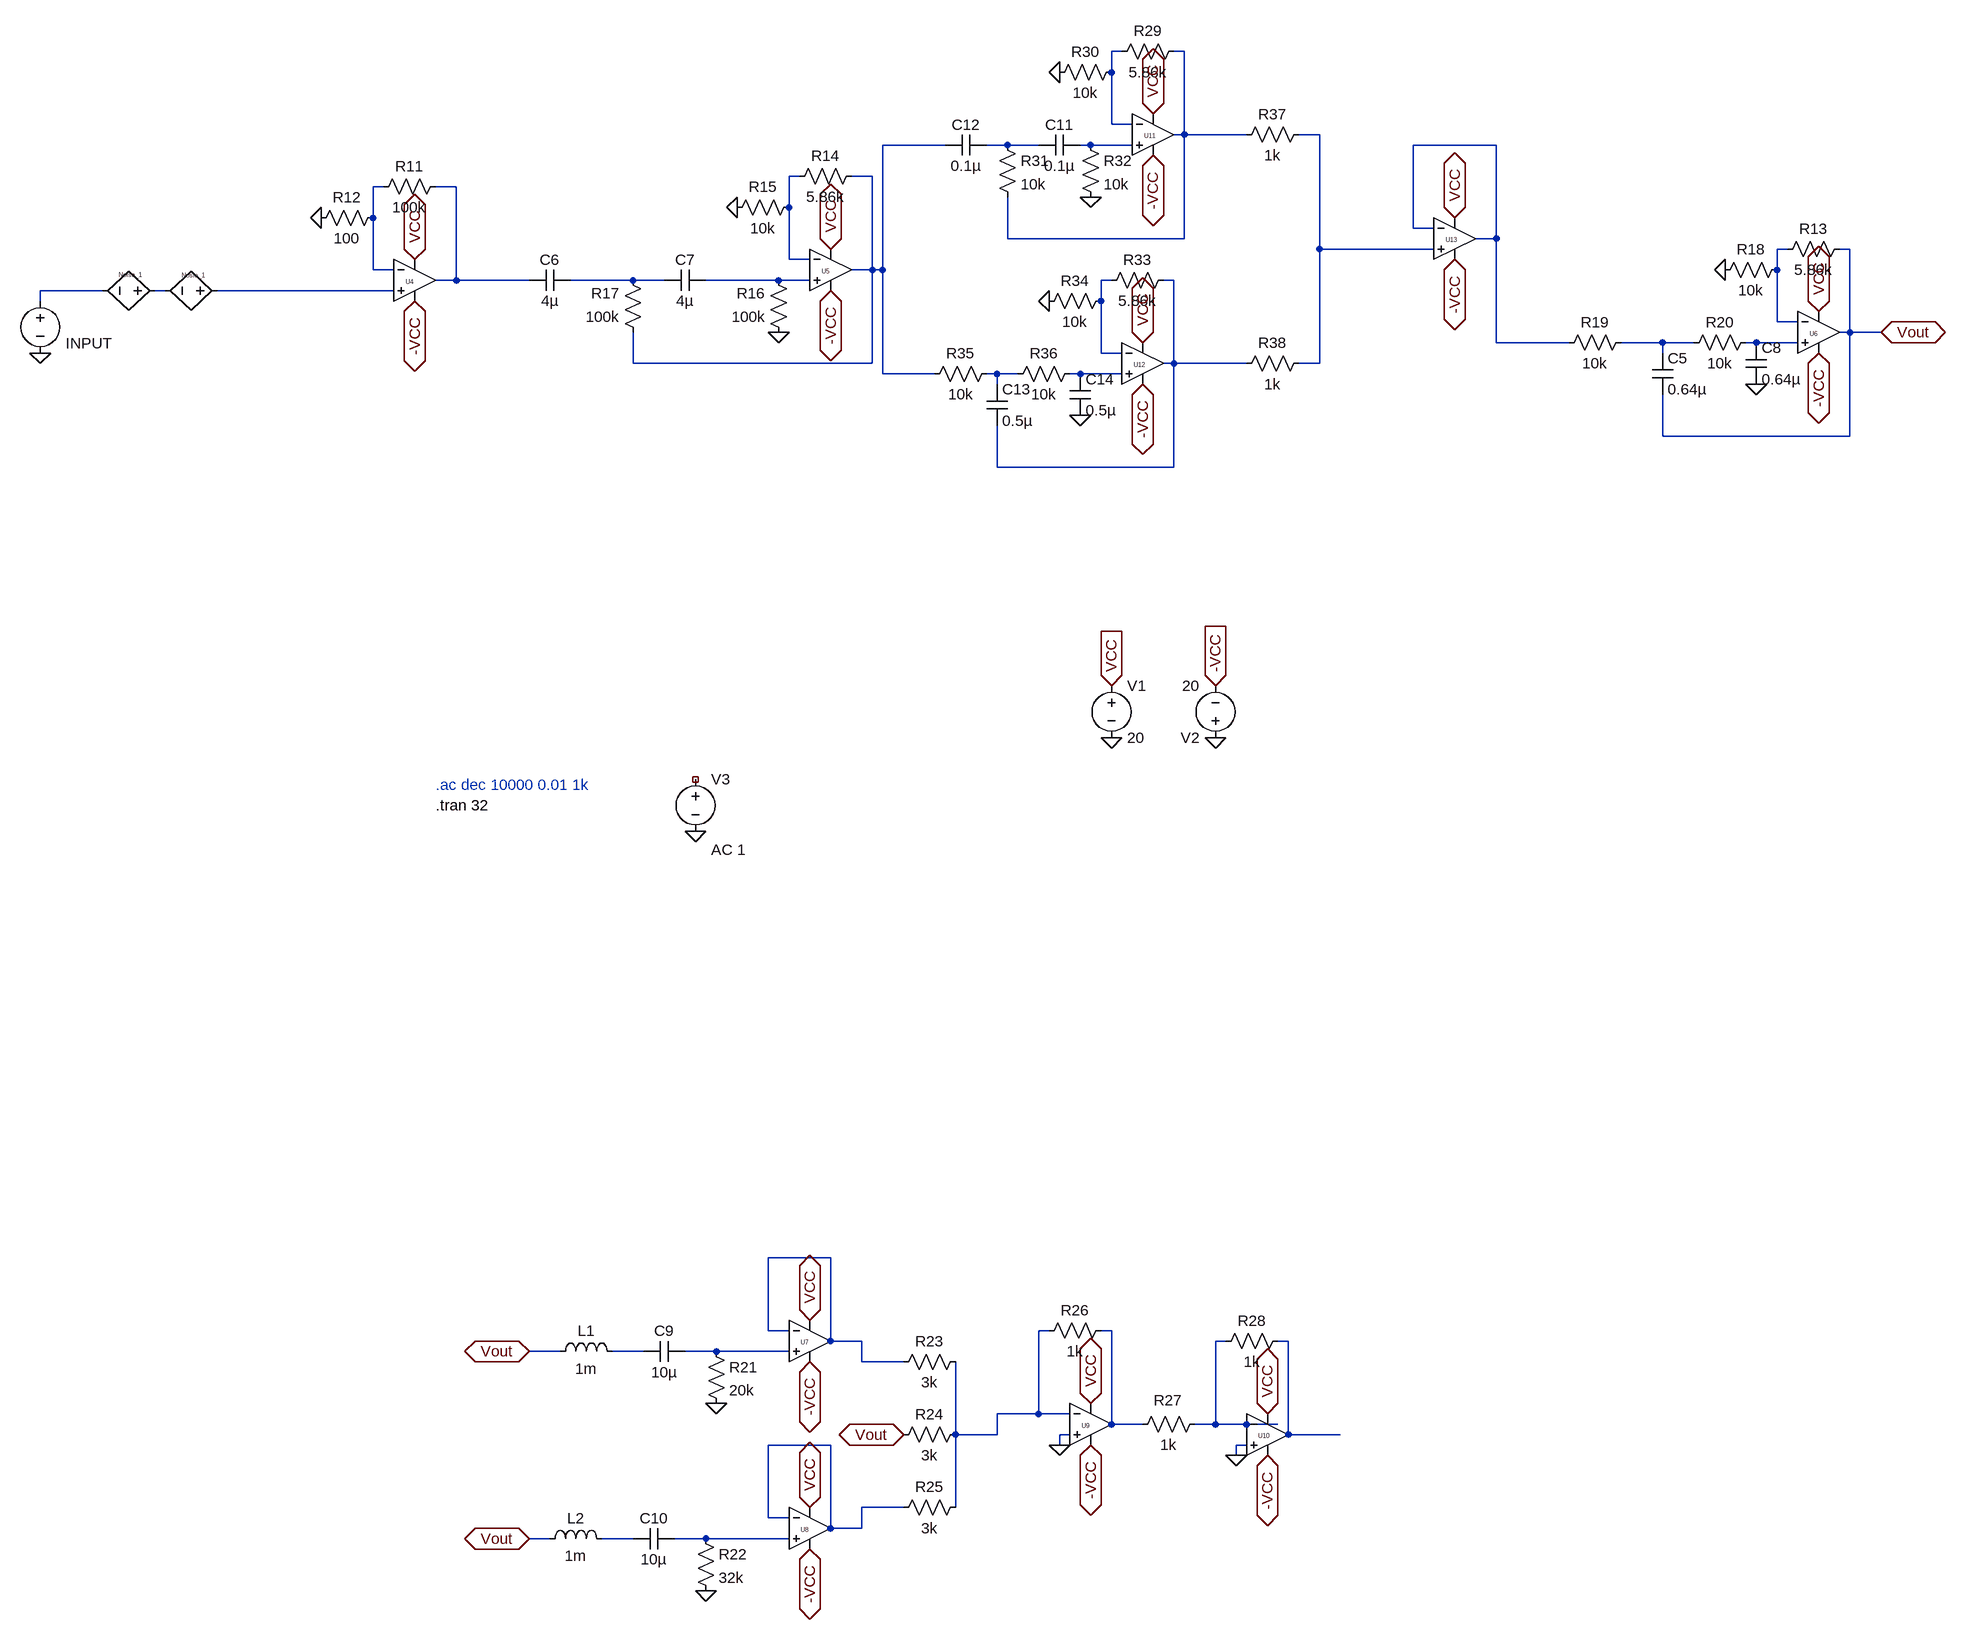
[diagram p0: schematic ECG processing.asc]
ECG processing.asc, the LTspice schematic file:
Version 4
SHEET 1 4004 2052
WIRE 1280 -368 1264 -368
WIRE 1376 -368 1360 -368
WIRE 1264 -336 1264 -368
WIRE 1264 -256 1264 -336
WIRE 1296 -256 1264 -256
WIRE 1376 -240 1376 -368
WIRE 1376 -240 1360 -240
WIRE 1472 -240 1376 -240
WIRE 1584 -240 1552 -240
WIRE 1008 -224 912 -224
WIRE 1104 -224 1072 -224
WIRE 1152 -224 1104 -224
WIRE 1232 -224 1216 -224
WIRE 1296 -224 1232 -224
WIRE 1856 -224 1728 -224
WIRE 784 -176 768 -176
WIRE 896 -176 864 -176
WIRE 144 -160 128 -160
WIRE 256 -160 224 -160
WIRE 768 -128 768 -176
WIRE 128 -112 128 -160
WIRE 1728 -96 1728 -224
WIRE 1760 -96 1728 -96
WIRE 1104 -80 1104 -144
WIRE 1376 -80 1376 -240
WIRE 1376 -80 1104 -80
WIRE 1856 -80 1856 -224
WIRE 1856 -80 1824 -80
WIRE 1584 -64 1584 -240
WIRE 1760 -64 1584 -64
WIRE 2304 -64 2288 -64
WIRE 2400 -64 2384 -64
WIRE 768 -48 768 -128
WIRE 800 -48 768 -48
WIRE 128 -32 128 -112
WIRE 160 -32 128 -32
WIRE 896 -32 896 -176
WIRE 896 -32 864 -32
WIRE 912 -32 912 -224
WIRE 912 -32 896 -32
WIRE 2288 -32 2288 -64
WIRE 256 -16 256 -160
WIRE 256 -16 224 -16
WIRE 368 -16 256 -16
WIRE 528 -16 432 -16
WIRE 576 -16 528 -16
WIRE 752 -16 640 -16
WIRE 800 -16 752 -16
WIRE 1264 -16 1248 -16
WIRE 1360 -16 1344 -16
WIRE -288 0 -384 0
WIRE -192 0 -208 0
WIRE 160 0 -112 0
WIRE -384 16 -384 0
WIRE 1248 16 1248 -16
WIRE 2288 48 2288 -32
WIRE 2320 48 2288 48
WIRE 2400 64 2400 -64
WIRE 2400 64 2384 64
WIRE 2448 64 2400 64
WIRE 1856 80 1856 -80
WIRE 1968 80 1856 80
WIRE 2112 80 2048 80
WIRE 2160 80 2112 80
WIRE 2256 80 2240 80
WIRE 2320 80 2256 80
WIRE 1248 96 1248 16
WIRE 1280 96 1248 96
WIRE 2112 96 2112 80
WIRE 528 112 528 64
WIRE 896 112 896 -32
WIRE 896 112 528 112
WIRE 1360 112 1360 -16
WIRE 1360 112 1344 112
WIRE 1472 112 1360 112
WIRE 1584 112 1584 -64
WIRE 1584 112 1552 112
WIRE 912 128 912 -32
WIRE 992 128 912 128
WIRE 1088 128 1072 128
WIRE 1120 128 1088 128
WIRE 1216 128 1200 128
WIRE 1280 128 1216 128
WIRE 1088 144 1088 128
WIRE 2112 224 2112 160
WIRE 2400 224 2400 64
WIRE 2400 224 2112 224
WIRE 1088 272 1088 208
WIRE 1360 272 1360 112
WIRE 1360 272 1088 272
WIRE 832 1488 736 1488
WIRE 736 1600 736 1488
WIRE 768 1600 736 1600
WIRE 1168 1600 1152 1600
WIRE 1264 1600 1248 1600
WIRE 832 1616 832 1488
WIRE 880 1616 832 1616
WIRE 1440 1616 1424 1616
WIRE 1536 1616 1520 1616
WIRE 416 1632 368 1632
WIRE 544 1632 496 1632
WIRE 656 1632 608 1632
WIRE 768 1632 656 1632
WIRE 880 1648 880 1616
WIRE 944 1648 880 1648
WIRE 1152 1728 1152 1600
WIRE 1152 1728 1088 1728
WIRE 1200 1728 1152 1728
WIRE 1264 1744 1264 1600
WIRE 1312 1744 1264 1744
WIRE 1424 1744 1424 1616
WIRE 1424 1744 1392 1744
WIRE 1472 1744 1424 1744
WIRE 1520 1744 1472 1744
WIRE 1024 1760 1024 1648
WIRE 1088 1760 1088 1728
WIRE 1088 1760 1024 1760
WIRE 1200 1760 1184 1760
WIRE 1536 1760 1536 1616
WIRE 1616 1760 1536 1760
WIRE 832 1776 736 1776
WIRE 1184 1776 1184 1760
WIRE 1472 1776 1456 1776
WIRE 1456 1792 1456 1776
WIRE 944 1872 880 1872
WIRE 1024 1872 1024 1760
WIRE 736 1888 736 1776
WIRE 768 1888 736 1888
WIRE 832 1904 832 1776
WIRE 880 1904 880 1872
WIRE 880 1904 832 1904
WIRE 400 1920 368 1920
WIRE 528 1920 480 1920
WIRE 640 1920 592 1920
WIRE 768 1920 640 1920
FLAG 1264 688 0
FLAG 1424 688 0
FLAG 1264 608 VCC
IOPIN 1264 608 In
FLAG 1424 608 -VCC
IOPIN 1424 608 In
FLAG 624 832 0
FLAG 832 -64 VCC
IOPIN 832 -64 BiDir
FLAG 832 0 -VCC
IOPIN 832 0 BiDir
FLAG 688 -128 0
FLAG 752 64 0
FLAG 192 -48 VCC
IOPIN 192 -48 BiDir
FLAG 192 16 -VCC
IOPIN 192 16 BiDir
FLAG 48 -112 0
FLAG -384 96 0
FLAG 2352 32 VCC
IOPIN 2352 32 BiDir
FLAG 2352 96 -VCC
IOPIN 2352 96 BiDir
FLAG 2208 -32 0
FLAG 2256 144 0
FLAG 656 1712 0
FLAG 640 2000 0
FLAG 2448 64 Vout
IOPIN 2448 64 BiDir
FLAG 368 1632 Vout
IOPIN 368 1632 BiDir
FLAG 368 1920 Vout
IOPIN 368 1920 BiDir
FLAG 800 1584 VCC
IOPIN 800 1584 BiDir
FLAG 800 1648 -VCC
IOPIN 800 1648 BiDir
FLAG 800 1872 VCC
IOPIN 800 1872 BiDir
FLAG 800 1936 -VCC
IOPIN 800 1936 BiDir
FLAG 1232 1712 VCC
IOPIN 1232 1712 BiDir
FLAG 1232 1776 -VCC
IOPIN 1232 1776 BiDir
FLAG 1184 1776 0
FLAG 944 1760 Vout
IOPIN 944 1760 BiDir
FLAG 1504 1728 VCC
IOPIN 1504 1728 BiDir
FLAG 1504 1792 -VCC
IOPIN 1504 1792 BiDir
FLAG 1456 1792 0
FLAG 1328 -272 VCC
IOPIN 1328 -272 BiDir
FLAG 1328 -208 -VCC
IOPIN 1328 -208 BiDir
FLAG 1184 -336 0
FLAG 1232 -144 0
FLAG 1312 80 VCC
IOPIN 1312 80 BiDir
FLAG 1312 144 -VCC
IOPIN 1312 144 BiDir
FLAG 1168 16 0
FLAG 1216 192 0
FLAG 1792 -112 VCC
IOPIN 1792 -112 BiDir
FLAG 1792 -48 -VCC
IOPIN 1792 -48 BiDir
SYMBOL voltage 1264 592 R0
WINDOW 123 0 0 Left 0
WINDOW 39 0 0 Left 0
SYMATTR InstName V1
SYMATTR Value 20
SYMBOL voltage 1424 704 R180
WINDOW 123 0 0 Left 0
WINDOW 39 0 0 Left 0
SYMATTR InstName V2
SYMATTR Value 20
SYMBOL voltage 624 736 R0
WINDOW 123 24 124 Left 2
WINDOW 39 0 0 Left 0
SYMATTR Value2 AC 1
SYMATTR InstName V3
SYMATTR Value ""
SYMBOL OpAmps\\UniversalOpAmp2 832 -32 R0
WINDOW 0 -14 2 Left 0
SYMATTR InstName U5
SYMBOL res 880 -192 R90
WINDOW 0 0 56 VBottom 2
WINDOW 3 32 56 VTop 2
SYMATTR InstName R14
SYMATTR Value 5.86k
SYMBOL res 784 -144 R90
WINDOW 0 0 56 VBottom 2
WINDOW 3 32 56 VTop 2
SYMATTR InstName R15
SYMATTR Value 10k
SYMBOL res 768 80 R180
WINDOW 0 36 76 Left 2
WINDOW 3 36 40 Left 2
SYMATTR InstName R16
SYMATTR Value 100k
SYMBOL cap 432 -32 R90
WINDOW 0 0 32 VBottom 2
WINDOW 3 32 32 VTop 2
SYMATTR InstName C6
SYMATTR Value 4µ
SYMBOL cap 640 -32 R90
WINDOW 0 0 32 VBottom 2
WINDOW 3 32 32 VTop 2
SYMATTR InstName C7
SYMATTR Value 4µ
SYMBOL res 544 80 R180
WINDOW 0 36 76 Left 2
WINDOW 3 36 40 Left 2
SYMATTR InstName R17
SYMATTR Value 100k
SYMBOL OpAmps\\UniversalOpAmp2 192 -16 R0
WINDOW 0 -14 2 Left 0
SYMATTR InstName U4
SYMBOL res 240 -176 R90
WINDOW 0 0 56 VBottom 2
WINDOW 3 32 56 VTop 2
SYMATTR InstName R11
SYMATTR Value 100k
SYMBOL res 144 -128 R90
WINDOW 0 0 56 VBottom 2
WINDOW 3 32 56 VTop 2
SYMATTR InstName R12
SYMATTR Value 100
SYMBOL voltage -384 0 R0
WINDOW 0 39 81 Left 2
WINDOW 3 24 96 Invisible 2
WINDOW 123 24 44 Left 2
WINDOW 39 0 0 Left 0
SYMATTR InstName INPUT
SYMATTR Value PWL file="C:\Users\Varad\Downloads\data (1).txt"
SYMBOL OpAmps\\UniversalOpAmp2 2352 64 R0
WINDOW 0 -14 2 Left 0
SYMATTR InstName U6
SYMBOL res 2288 -48 R270
WINDOW 0 32 56 VTop 2
WINDOW 3 0 56 VBottom 2
SYMATTR InstName R13
SYMATTR Value 5.86k
SYMBOL res 2192 -16 R270
WINDOW 0 32 56 VTop 2
WINDOW 3 0 56 VBottom 2
SYMATTR InstName R18
SYMATTR Value 10k
SYMBOL res 2064 64 R90
WINDOW 0 0 56 VBottom 2
WINDOW 3 32 56 VTop 2
SYMATTR InstName R19
SYMATTR Value 10k
SYMBOL res 2256 64 R90
WINDOW 0 0 56 VBottom 2
WINDOW 3 32 56 VTop 2
SYMATTR InstName R20
SYMATTR Value 10k
SYMBOL cap 2096 96 R0
SYMATTR InstName C5
SYMATTR Value 0.64µ
SYMBOL cap 2240 80 R0
SYMATTR InstName C8
SYMATTR Value 0.64µ
SYMBOL bv -192 0 R90
WINDOW 0 -18 53 VBottom 0
WINDOW 3 -4 56 Invisible 2
SYMATTR InstName Noise_1
SYMATTR Value V=WHITE(314*time)*0.0001
SYMBOL bv -96 0 R90
WINDOW 0 -17 52 VBottom 0
WINDOW 3 32 56 Invisible 2
SYMATTR InstName Nosie_1
SYMATTR Value V= idt(white(0.628*time))*0.00001
SYMBOL ind 400 1648 R270
WINDOW 0 32 56 VTop 2
WINDOW 3 5 56 VBottom 2
SYMATTR InstName L1
SYMATTR Value 1m
SYMBOL cap 608 1616 R90
WINDOW 0 0 32 VBottom 2
WINDOW 3 32 32 VTop 2
SYMATTR InstName C9
SYMATTR Value 10µ
SYMBOL res 640 1616 R0
SYMATTR InstName R21
SYMATTR Value 20k
SYMBOL ind 384 1936 R270
WINDOW 0 32 56 VTop 2
WINDOW 3 5 56 VBottom 2
SYMATTR InstName L2
SYMATTR Value 1m
SYMBOL cap 592 1904 R90
WINDOW 0 0 32 VBottom 2
WINDOW 3 32 32 VTop 2
SYMATTR InstName C10
SYMATTR Value 10µ
SYMBOL res 624 1904 R0
SYMATTR InstName R22
SYMATTR Value 32k
SYMBOL OpAmps\\UniversalOpAmp2 800 1616 R0
WINDOW 0 -14 2 Left 0
SYMATTR InstName U7
SYMBOL OpAmps\\UniversalOpAmp2 800 1904 R0
WINDOW 0 -14 2 Left 0
SYMATTR InstName U8
SYMBOL res 1040 1632 R90
WINDOW 0 0 56 VBottom 2
WINDOW 3 32 56 VTop 2
SYMATTR InstName R23
SYMATTR Value 3k
SYMBOL res 1040 1744 R90
WINDOW 0 0 56 VBottom 2
WINDOW 3 32 56 VTop 2
SYMATTR InstName R24
SYMATTR Value 3k
SYMBOL res 1040 1856 R90
WINDOW 0 0 56 VBottom 2
WINDOW 3 32 56 VTop 2
SYMATTR InstName R25
SYMATTR Value 3k
SYMBOL OpAmps\\UniversalOpAmp2 1232 1744 R0
WINDOW 0 -14 2 Left 0
SYMATTR InstName U9
SYMBOL res 1264 1584 R90
WINDOW 0 0 56 VBottom 2
WINDOW 3 32 56 VTop 2
SYMATTR InstName R26
SYMATTR Value 1k
SYMBOL res 1408 1728 R90
WINDOW 0 -5 57 VBottom 2
WINDOW 3 32 56 VTop 2
SYMATTR InstName R27
SYMATTR Value 1k
SYMBOL OpAmps\\UniversalOpAmp2 1504 1760 R0
WINDOW 0 -14 2 Left 0
SYMATTR InstName U10
SYMBOL res 1536 1600 R90
WINDOW 0 0 56 VBottom 2
WINDOW 3 32 56 VTop 2
SYMATTR InstName R28
SYMATTR Value 1k
SYMBOL OpAmps\\UniversalOpAmp2 1328 -240 R0
WINDOW 0 -14 2 Left 0
SYMATTR InstName U11
SYMBOL res 1264 -352 R270
WINDOW 0 32 56 VTop 2
WINDOW 3 0 56 VBottom 2
SYMATTR InstName R29
SYMATTR Value 5.86k
SYMBOL res 1168 -320 R270
WINDOW 0 32 56 VTop 2
WINDOW 3 0 56 VBottom 2
SYMATTR InstName R30
SYMATTR Value 10k
SYMBOL res 1088 -240 R0
SYMATTR InstName R31
SYMATTR Value 10k
SYMBOL res 1216 -240 R0
SYMATTR InstName R32
SYMATTR Value 10k
SYMBOL cap 1216 -240 R90
WINDOW 0 0 32 VBottom 2
WINDOW 3 32 32 VTop 2
SYMATTR InstName C11
SYMATTR Value 0.1µ
SYMBOL cap 1072 -240 R90
WINDOW 0 0 32 VBottom 2
WINDOW 3 32 32 VTop 2
SYMATTR InstName C12
SYMATTR Value 0.1µ
SYMBOL OpAmps\\UniversalOpAmp2 1312 112 R0
WINDOW 0 -14 2 Left 0
SYMATTR InstName U12
SYMBOL res 1248 0 R270
WINDOW 0 32 56 VTop 2
WINDOW 3 0 56 VBottom 2
SYMATTR InstName R33
SYMATTR Value 5.86k
SYMBOL res 1152 32 R270
WINDOW 0 32 56 VTop 2
WINDOW 3 0 56 VBottom 2
SYMATTR InstName R34
SYMATTR Value 10k
SYMBOL res 1088 112 R90
WINDOW 0 0 56 VBottom 2
WINDOW 3 32 56 VTop 2
SYMATTR InstName R35
SYMATTR Value 10k
SYMBOL res 1216 112 R90
WINDOW 0 0 56 VBottom 2
WINDOW 3 32 56 VTop 2
SYMATTR InstName R36
SYMATTR Value 10k
SYMBOL cap 1072 144 R0
SYMATTR InstName C13
SYMATTR Value 0.5µ
SYMBOL cap 1200 128 R0
SYMATTR InstName C14
SYMATTR Value 0.5µ
SYMBOL OpAmps\\UniversalOpAmp2 1792 -80 R0
WINDOW 0 -14 2 Left 0
SYMATTR InstName U13
SYMBOL res 1568 -256 R90
WINDOW 0 0 56 VBottom 2
WINDOW 3 32 56 VTop 2
SYMATTR InstName R37
SYMATTR Value 1k
SYMBOL res 1568 96 R90
WINDOW 0 0 56 VBottom 2
WINDOW 3 32 56 VTop 2
SYMATTR InstName R38
SYMATTR Value 1k
TEXT 224 760 Left 2 ;.ac dec 10000 0.01 1k
TEXT 224 792 Left 2 !.tran 32

The netlist it stands for:
* ECG processing.asc
V1 VCC 0 20
V2 0 -VCC 20
V3 NC_01 0 AC 1
XU5 N013 N008 VCC -VCC N004 level2 Avol=1Meg GBW=10Meg Slew=10Meg Ilimit=25m Rail=0 Vos=0 En=0 Enk=0 In=0 Ink=0 Rin=500Meg  ; pins In+ In- V+ V- OUT
R14 N004 N008 5.86k
R15 N008 0 10k
R16 0 N013 100k
C6 N012 N010 4µ
C7 N013 N012 4µ
R17 N004 N012 100k
XU4 N018 N009 VCC -VCC N010 level2 Avol=1Meg GBW=10Meg Slew=10Meg Ilimit=25m Rail=0 Vos=0 En=0 Enk=0 In=0 Ink=0 Rin=500Meg  ; pins In+ In- V+ V- OUT
R11 N010 N009 100k
R12 N009 0 100
V§INPUT N016 0 PWL file="C:\Users\Varad\Downloads\data (1).txt"
XU6 N020 N011 VCC -VCC Vout level2 Avol=1Meg GBW=10Meg Slew=10Meg Ilimit=25m Rail=0 Vos=0 En=0 Enk=0 In=0 Ink=0 Rin=500Meg  ; pins In+ In- V+ V- OUT
R13 N011 Vout 5.86k
R18 0 N011 10k
R19 N019 N007 10k
R20 N020 N019 10k
C5 N019 Vout 0.64µ
C8 N020 0 0.64µ
B§Noise_1 N017 N016 V=WHITE(314*time)*0.0001
B§Nosie_1 N018 N017 V= idt(white(0.628*time))*0.00001
L1 Vout N028 1m
C9 N029 N028 10µ
R21 N029 0 20k
L2 Vout N031 1m
C10 N032 N031 10µ
R22 N032 0 32k
XU7 N029 N023 VCC -VCC N023 level2 Avol=1Meg GBW=10Meg Slew=10Meg Ilimit=25m Rail=0 Vos=0 En=0 Enk=0 In=0 Ink=0 Rin=500Meg  ; pins In+ In- V+ V- OUT
XU8 N032 N030 VCC -VCC N030 level2 Avol=1Meg GBW=10Meg Slew=10Meg Ilimit=25m Rail=0 Vos=0 En=0 Enk=0 In=0 Ink=0 Rin=500Meg  ; pins In+ In- V+ V- OUT
R23 N024 N023 3k
R24 N024 Vout 3k
R25 N024 N030 3k
XU9 0 N024 VCC -VCC N025 level2 Avol=1Meg GBW=10Meg Slew=10Meg Ilimit=25m Rail=0 Vos=0 En=0 Enk=0 In=0 Ink=0 Rin=500Meg  ; pins In+ In- V+ V- OUT
R26 N025 N024 1k
R27 N026 N025 1k
XU10 0 N026 VCC -VCC N027 level2 Avol=1Meg GBW=10Meg Slew=10Meg Ilimit=25m Rail=0 Vos=0 En=0 Enk=0 In=0 Ink=0 Rin=500Meg  ; pins In+ In- V+ V- OUT
R28 N027 N026 1k
XU11 N006 N001 VCC -VCC N002 level2 Avol=1Meg GBW=10Meg Slew=10Meg Ilimit=25m Rail=0 Vos=0 En=0 Enk=0 In=0 Ink=0 Rin=500Meg  ; pins In+ In- V+ V- OUT
R29 N001 N002 5.86k
R30 0 N001 10k
R31 N005 N002 10k
R32 N006 0 10k
C11 N006 N005 0.1µ
C12 N005 N004 0.1µ
XU12 N022 N014 VCC -VCC N015 level2 Avol=1Meg GBW=10Meg Slew=10Meg Ilimit=25m Rail=0 Vos=0 En=0 Enk=0 In=0 Ink=0 Rin=500Meg  ; pins In+ In- V+ V- OUT
R33 N014 N015 5.86k
R34 0 N014 10k
R35 N021 N004 10k
R36 N022 N021 10k
C13 N021 N015 0.5µ
C14 N022 0 0.5µ
XU13 N003 N007 VCC -VCC N007 level2 Avol=1Meg GBW=10Meg Slew=10Meg Ilimit=25m Rail=0 Vos=0 En=0 Enk=0 In=0 Ink=0 Rin=500Meg  ; pins In+ In- V+ V- OUT
R37 N003 N002 1k
R38 N003 N015 1k
* .ac dec 10000 0.01 1k
.tran 32
.lib UniversalOpAmp2.lib
.backanno
.end